# Altium schematic sheet CurrentSens.SchDoc: Current Sensors
size A4; DrawnBy: Jarod Krane; Organization: Altium Limited; Address1: L3, 12a Rodborough Rd; Address2: Frenchs Forest; Address3: NSW; Address4: Australia 2086; Revision: 0; SheetNumber: 9; SheetTotal: 11
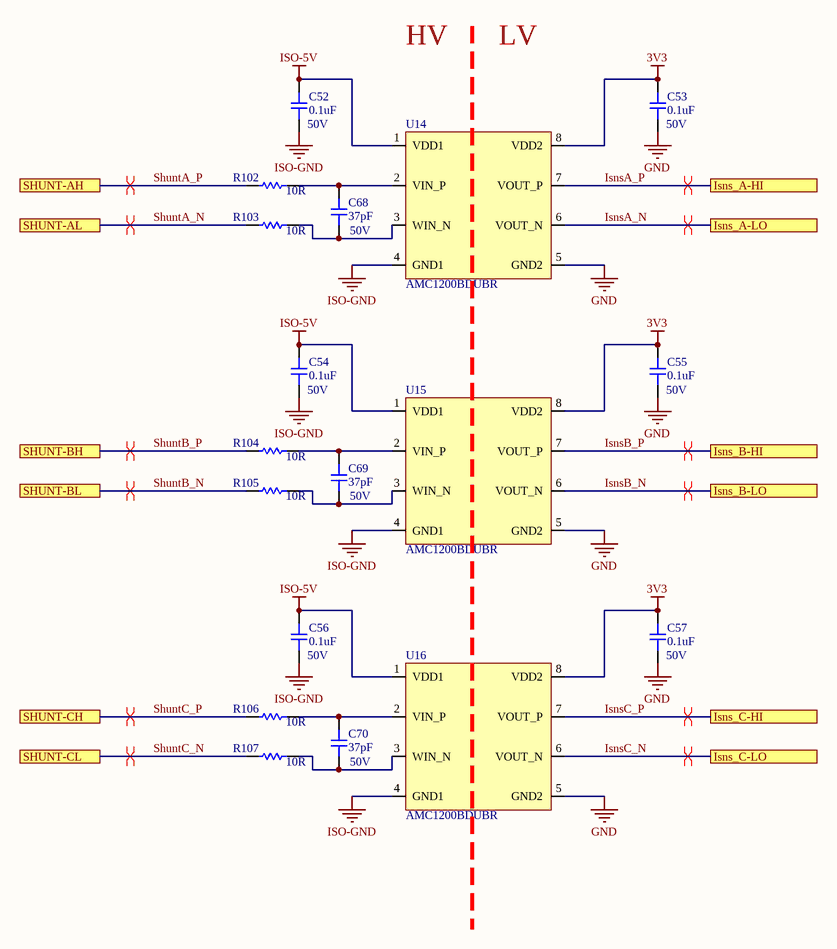
[diagram p0: CurrentSens.SchDoc]

## Parts
C52  0.1uF  Voltage: 50V  [CAP-0805]
C53  0.1uF  Voltage: 50V  [CAP-0805]
C54  0.1uF  Voltage: 50V  [CAP-0805]
C55  0.1uF  Voltage: 50V  [CAP-0805]
C56  0.1uF  Voltage Rating: 50V  [CAP-0805]
C57  0.1uF  Voltage: 50V  [CAP-0805]
C68  37pF  Voltage: 50V  [CAP-0805]
C69  37pF  Voltage: 50V  [CAP-0805]
C70  37pF  Voltage: 50V  [CAP-0805]
R102  10R  [RES-0603]
R103  10R  [RES-0603]
R104  10R  [RES-0603]
R105  10R  [RES-0603]
R106  10R  [RES-0603]
R107  10R  [RES-0603]
U14  AMC1200BDUBR  [8-SOP]
U15  AMC1200BDUBR  [8-SOP]
U16  AMC1200BDUBR  [8-SOP]

## Ports
Isns_A-HI, Isns_A-LO, Isns_B-HI, Isns_B-LO, Isns_C-HI, Isns_C-LO, SHUNT-AH, SHUNT-AL, SHUNT-BH, SHUNT-BL, SHUNT-CH, SHUNT-CL

## Nets
3V3: C53.2 C55.2 C57.2 U14.8(VDD2) U15.8(VDD2) U16.8(VDD2)
GND: C53.1 C55.1 C57.1 U14.5(GND2) U15.5(GND2) U16.5(GND2)
ISO-5V: C52.2 C54.2 C56.2 U14.1(VDD1) U15.1(VDD1) U16.1(VDD1)
ISO-GND: C52.1 C54.1 C56.1 U14.4(GND1) U15.4(GND1) U16.4(GND1)
IsnsA_N: U14.6(VOUT_N) ; port Isns_A-LO
IsnsA_P: U14.7(VOUT_P) ; port Isns_A-HI
IsnsB_N: U15.6(VOUT_N) ; port Isns_B-LO
IsnsB_P: U15.7(VOUT_P) ; port Isns_B-HI
IsnsC_N: U16.6(VOUT_N) ; port Isns_C-LO
IsnsC_P: U16.7(VOUT_P) ; port Isns_C-HI
ShuntA_N: R103.2 ; port SHUNT-AL
ShuntA_P: R102.2 ; port SHUNT-AH
ShuntB_N: R105.2 ; port SHUNT-BL
ShuntB_P: R104.2 ; port SHUNT-BH
ShuntC_N: R107.2 ; port SHUNT-CL
ShuntC_P: R106.2 ; port SHUNT-CH
NetC68_1: C68.1 R103.1 U14.3(WIN_N)
NetC68_2: C68.2 R102.1 U14.2(VIN_P)
NetC69_1: C69.1 R105.1 U15.3(WIN_N)
NetC69_2: C69.2 R104.1 U15.2(VIN_P)
NetC70_1: C70.1 R107.1 U16.3(WIN_N)
NetC70_2: C70.2 R106.1 U16.2(VIN_P)

## Layout directives
differential pair: IsnsA_N, IsnsA_P, IsnsB_N, IsnsB_P, IsnsC_N, IsnsC_P, ShuntA_N, ShuntA_P, ShuntB_N, ShuntB_P, ShuntC_N, ShuntC_P

## Notes on the sheet
- HV
- LV
- Title
- Size:
- Date:
- A4
- Number:
- Time:
- Revision:
- Sheet
- of
- File:

## Library data of the parts
C52-C57 = 0805-0.1uF-50V: CAP CER 0.1UF 50V Y5V 0805; Manufacturer: KEMET; Manufacturer Part Number: C0805C104Z5VACTU; Dielectric Material: Ceramic; Capacitance: 100nF; Tolerance: 80%; Dissipation Factor: 5%; Supplier 1: Digi-Key; Stock 1: 929243; Pricing 1: 1=0.1, 10=0.057, 100=0.0254, 500=0.01818, 1000=0.01428 (USD); Mount: Surface Mount,PCB; Case/Package: 0805; Number of Pins: 2; Case Code (Metric): 2012; Case Code (Imperial): 0805; Min Operating Temperature: -30°C; Max Operating Temperature: 85°C; Package Quantity: 1; Packaging: Tape and Reel; Voltage Rating (DC): 50V; Dielectric: Y5V; Termination: SMD/SMT; Length: 2mm; Height: 0.9mm; Lead Pitch: 0.75mm; Width: 0.049inch; Thickness: 0.039inch; Depth: 1.25mm; Radiation Hardening: No; REACH SVHC: No SVHC; Lead Free: Lead Free; ComponentLink1URL: http://www.alliedelec.com/m/d/9bfe7773041ffe9d406e68bc7b377fdd.pdf?src-supplier=Allied+Electronics; ComponentLink1Description: http://www.alliedelec.com/m/d/9bfe7773041ffe9d406e68bc7b377fdd.pdf?src-supplier=Allied+Electronics; ComponentLink2URL: https://www.verical.com/server-webapp/html/getDatasheet?partID=37101&src-supplier=Verical; ComponentLink2Description: https://www.verical.com/server-webapp/html/getDatasheet?partID=37101&src-supplier=Verical; ComponentLink3URL: https://www.verical.com/server-webapp/html/getDatasheet?partID=321176&src-supplier=Verical; ComponentLink3Description: https://www.verical.com/server-webapp/html/getDatasheet?partID=321176&src-supplier=Verical; ComponentLink4URL: http://www.farnell.com/datasheets/2123124.pdf?src-supplier=Element14; ComponentLink4Description: http://www.farnell.com/datasheets/2123124.pdf?src-supplier=Element14; Supplier Part Number 1: 399-1177-6-ND
  C52-C55 C57: Voltage Rating: 50V
  C56: Voltage: 50V
C68-C70 = 0805-39pF-50V: CAP CER 39PF 50V C0G/NP0 0805; Manufacturer: Samsung; Manufacturer Part Number: CL21C390JBANNNC; Material: Ceramic; Tolerance: 5%; Dielectric: C0G; Temperature Coefficient: 300ppm/°C; Supplier 1: Digi-Key; Stock 1: 62860; Pricing 1: 1=0.1, 10=0.045, 50=0.0248, 100=0.0202, 500=0.01444, 1000=0.01135 (USD); Mount: Surface Mount; Case/Package: 0805; Case Code (Metric): 2012; Case Code (Imperial): 0805; Min Operating Temperature: -55°C; Max Operating Temperature: 125°C; Package Quantity: 1; Packaging: Tape and Reel; Voltage Rating: 50V; Series: CL; Construction: Flat; Length: 2mm; Width: 0.049inch; Height: 0.65mm; Thickness: 0.03inch; Depth: 1.25mm; Radiation Hardening: No; RoHS Compliant: Yes; ComponentLink1URL: http://www1.futureelectronics.com/doc/SAMSUNG%20PASSIVE/CL05B104KQ5NNNC.pdf?src-supplier=Future+Electronics; ComponentLink1Description: http://www1.futureelectronics.com/doc/SAMSUNG%20PASSIVE/CL05B104KQ5NNNC.pdf?src-supplier=Future+Electronics; ComponentLink2URL: https://www.verical.com/server-webapp/html/getDatasheet?partID=480498&src-supplier=Verical; ComponentLink2Description: https://www.verical.com/server-webapp/html/getDatasheet?partID=480498&src-supplier=Verical; ComponentLink3URL: https://produktinfo.conrad.com/datenblaetter/450000-474999/454441-da-01-en-VS_KONDENSATOR_0805.pdf?src-supplier=Conrad; ComponentLink3Description: https://produktinfo.conrad.com/datenblaetter/450000-474999/454441-da-01-en-VS_KONDENSATOR_0805.pdf?src-supplier=Conrad; Supplier Part Number 1: 1276-1769-1-ND; Capacitance: 39pF
R102-R107 = 0603-10R: RES SMD 10 OHM 1% 1/10W 0603; Manufacturer: Yageo; Manufacturer Part Number: RC0603FR-0710RL; Voltage Rating (DC): 50V; Temperature Coefficient: 200ppm/°C; Power Rating: 100mW; Supplier 1: Digi-Key; Stock 1: 11151092; Pricing 1: 1=0.1, 10=0.046, 100=0.0187, 1000=0.0084, 2500=0.00729 (USD); Case/Package: 0603; Number of Pins: 2; Case Code (Imperial): 0603; Case Code (Metric): 1608; Contact Plating: Tin,Matte; Min Operating Temperature: -55°C; Max Operating Temperature: 155°C; Packaging: Tape and Reel; Resistance: 10R; Tolerance: 1%; Composition: Thick Film; Voltage Rating: 50V; Termination: SMD/SMT; Military Standard: Not; Length: 1.6mm; Height: 0.45mm; Width: 0.8mm; Depth: 0.8mm; Radiation Hardening: No; REACH SVHC: No SVHC; Lead Free: Lead Free; ComponentLink1URL: http://www.farnell.com/datasheets/1868787.pdf?src-supplier=Element14; ComponentLink1Description: http://www.farnell.com/datasheets/1868787.pdf?src-supplier=Element14; ComponentLink2URL: http://www.yageo.com/documents/recent/PYu-RC0603_51_RoHS_L_4.pdf?src-supplier=Avnet; ComponentLink2Description: http://www.yageo.com/documents/recent/PYu-RC0603_51_RoHS_L_4.pdf?src-supplier=Avnet; ComponentLink3URL: http://documents.rs-components.com/techlib://itc_doclist_GB.htm?stockno=5048984&src-supplier=RSComponents; ComponentLink3Description: http://documents.rs-components.com/techlib://itc_doclist_GB.htm?stockno=5048984&src-supplier=RSComponents; ComponentLink4URL: http://www.yageo.com/documents/recent/PYu-RC0603_51_RoHS_L_4.pdf?src-supplier=Avnet+Europe; ComponentLink4Description: http://www.yageo.com/documents/recent/PYu-RC0603_51_RoHS_L_4.pdf?src-supplier=Avnet+Europe; Supplier Part Number 1: 311-10.0HRDKR-ND
U14-U16 = ISO-OPAMP: IC OPAMP ISOLATION 1 CIRC 8SOP; Manufacturer: Texas Instruments; Number of Channels: 1; Common Mode Rejection Ratio: 95dB; Operating Supply Voltage: 5.5V; -3db Bandwidth: 100kHz; Nominal Supply Current: 5.4mA; Output Current: 20mA; Max Input Voltage: 320mV; Input Offset Voltage (Vos): 200uV; Power Dissipation: 44mW; Power Supply Rejection Ratio (PSRR): 61dB; Dual Supply Voltage: 5V; Power Consumption: 82.5mW; Supplier 1: Digi-Key; Manufacturer Part Number: AMC1200BDUBR; Stock 1: 0; Pricing 1: 1=4.92, 10=4.415, 25=4.1736, 100=3.6172 (USD); Mount: Surface Mount; Case/Package: SOP; Number of Pins: 8; Min Operating Temperature: -40°C; Max Operating Temperature: 105°C; Max Dual Supply Voltage: 5.5V; Packaging: Tape and Reel; Package Quantity: 350; Bandwidth: 100kHz; Number of Circuits: 1; Operating Supply Current: 5.4mA; Output Current per Channel: 20mA; Max Power Dissipation: 44mW; Number of Elements: 1; Series: -; Amplifier Type: ISOLATION; Supply Current: 5.4mA; Lead Free: Lead Free; RoHS Compliant: Yes; ComponentLink1URL: http://www.ti.com/general/docs/lit/getliterature.tsp?genericPartNumber=AMC1200&&fileType=pdf&src-supplier=Avnet; ComponentLink1Description: http://www.ti.com/general/docs/lit/getliterature.tsp?genericPartNumber=AMC1200&&fileType=pdf&src-supplier=Avnet; ComponentLink2URL: http://www.ti.com/lit/ds/symlink/amc1200.pdf?src-supplier=Digi-Key; ComponentLink2Description: http://www.ti.com/lit/ds/symlink/amc1200.pdf?src-supplier=Digi-Key; Supplier Part Number 1: 296-38868-6-ND